# EAGLE design freiBot_pro_micro_DIP_v1.0 (EAGLE 7.5.0)
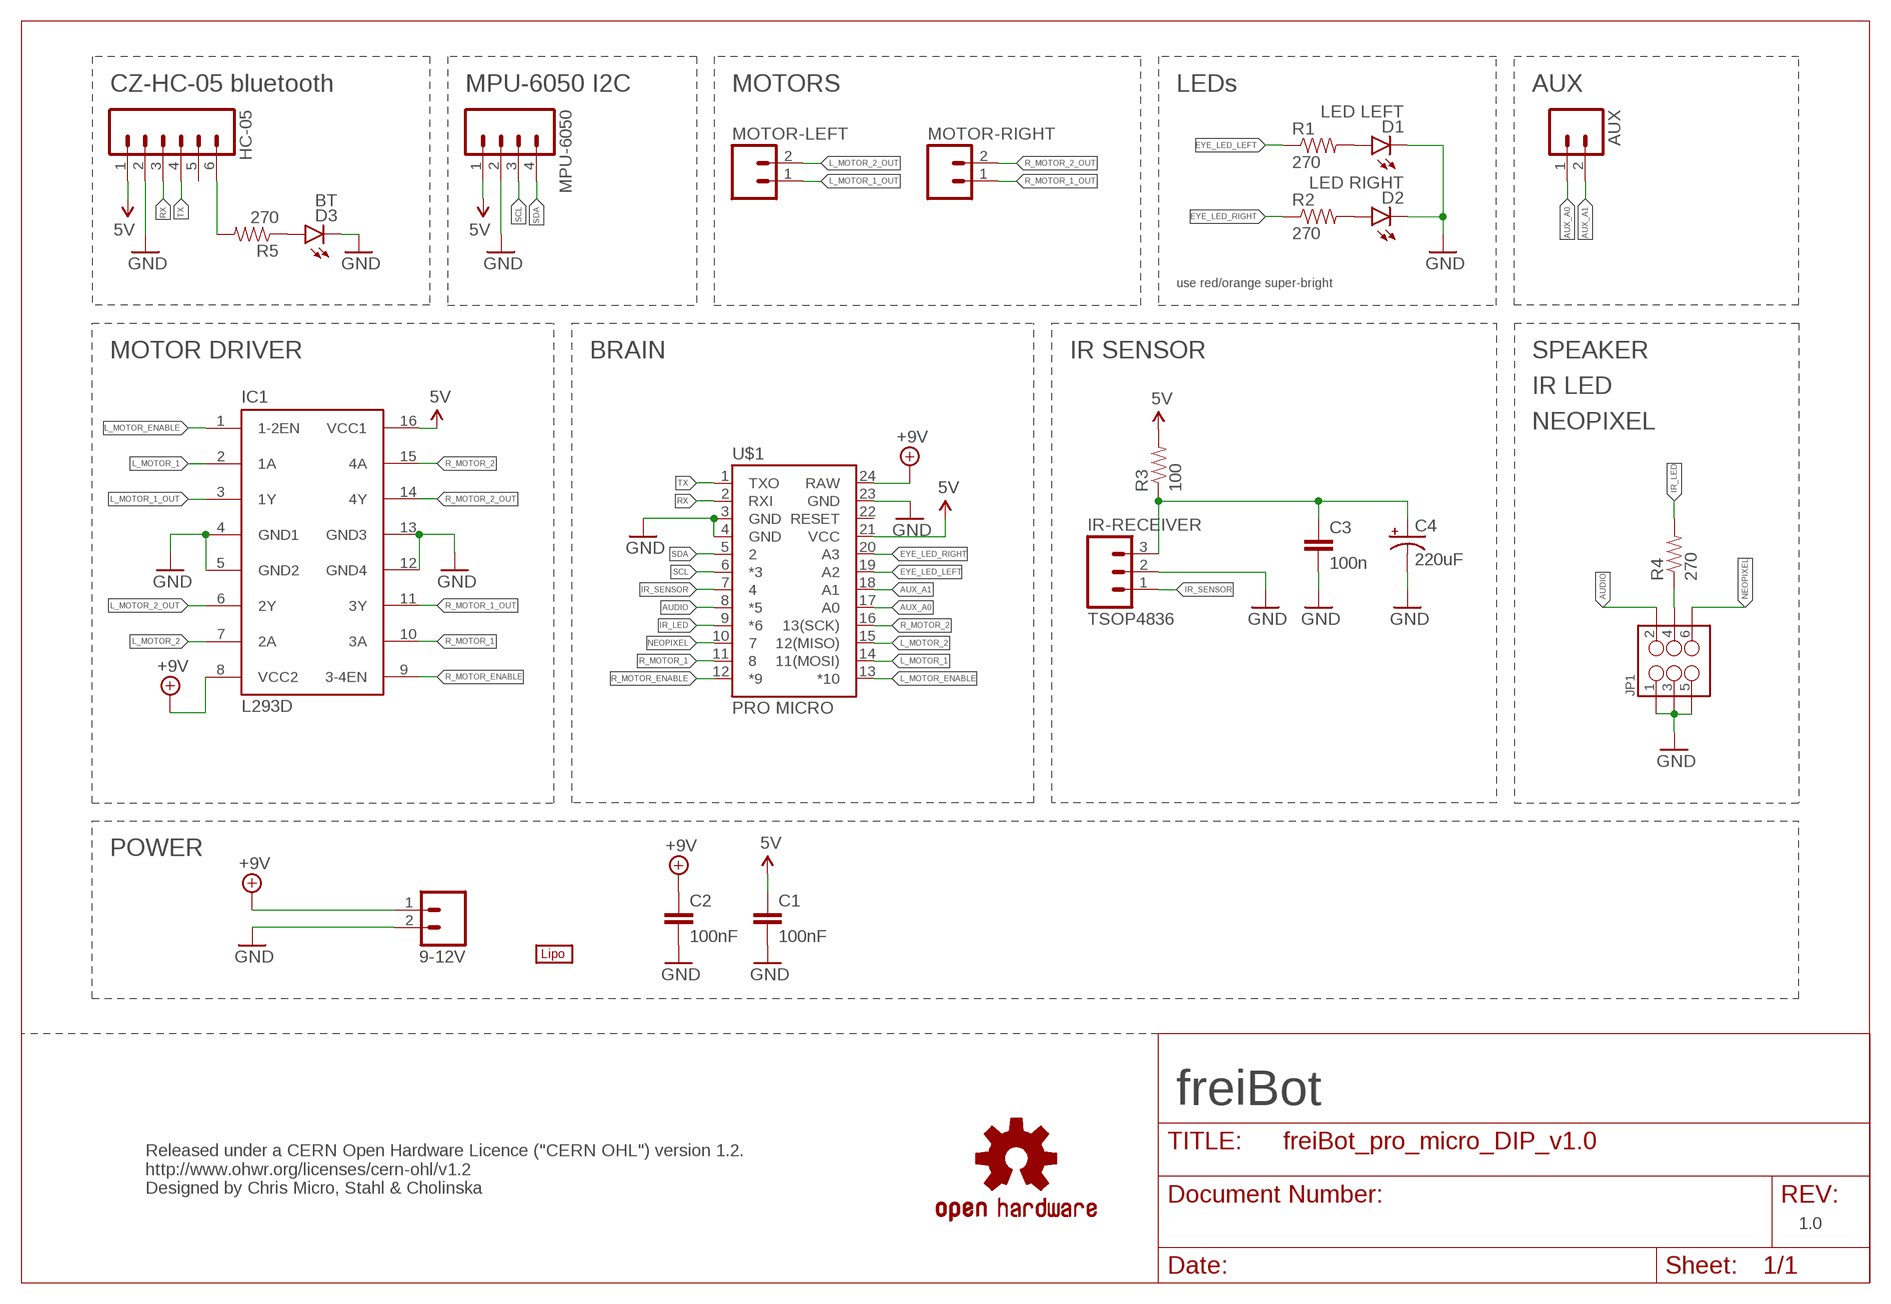
[diagram p0: schematic, sheet 1]

## Parts
9-12V  M025MM  [SCREWTERMINAL-5MM-2]
AUX  M02LOCK_LONGPADS  [1X02_LOCK_LONGPADS]
C1  100nF  0.1UF-50V-20%(PTH)KIT-EZ  [CAP-PTH-SMALL-KIT]
C2  100nF  0.1UF-50V-20%(PTH)KIT-EZ  [CAP-PTH-SMALL-KIT]
C3  100n  0.1UF-50V-20%(PTH)KIT-EZ  [CAP-PTH-SMALL-KIT]
C4  220uF  CAP_POLPTH1  [CPOL-RADIAL-100UF-25V]
D1  LED LEFT  LED3MM  [LED3MM]
D2  LED RIGHT  LED3MM  [LED3MM]
D3  BT  LED3MM  [LED3MM]
HC-05  M06LONGPADS  [1X06_LONGPADS]
IC1  L293D  [DIL16]
IR-RECEIVER  TSOP4836  M03LONGPADS  [1X03_LONGPADS]
JP1  M03X2NO_SILK  [2X3-NS]
LOGO1  OSHW-LOGOL-COPPER  [OSHW-LOGO-L_COPPER]
MOTOR-LEFT  M025MM  [SCREWTERMINAL-5MM-2]
MOTOR-RIGHT  M025MM  [SCREWTERMINAL-5MM-2]
MPU-6050  M04LONGPADS  [1X04_LONGPADS]
R1  270  RESISTORKIT  [AXIAL-0.3-KIT]
R2  270  RESISTORKIT  [AXIAL-0.3-KIT]
R3  100  RESISTORKIT  [AXIAL-0.3-KIT]
R4  270  RESISTORKIT  [AXIAL-0.3-KIT]
R5  270  RESISTORKIT  [AXIAL-0.3-KIT]
U$1  PRO MICRO  ARDUINO_PRO_MICRO  [ARDUINO_PRO_MICRO]
U$2  LIPO-OUTLINE2000  [LIPO-2000]

## Nets
5V: C1.1 HC-05.1 IC1.16(VCC1) MPU-6050.1 R3.P$2 U$1.21(VCC)
+9V: 9-12V.1 C2.1 IC1.8(VCC2) U$1.24(RAW)
AUDIO: JP1.2 U$1.8(*5)
AUX_A0: AUX.1 U$1.17(A0)
AUX_A1: AUX.2 U$1.18(A1)
EYE_LED_LEFT: R1.P$1 U$1.19(A2)
EYE_LED_RIGHT: R2.P$1 U$1.20(A3)
GND: 9-12V.2 C1.2 C2.2 C3.2 C4.2(-) D1.K(C) D2.K(C) D3.K(C) HC-05.2 IC1.4(GND1) IC1.5(GND2) IC1.12(GND4) IC1.13(GND3) IR-RECEIVER.2 JP1.1 JP1.3 JP1.5 MPU-6050.2 U$1.3(GND) U$1.4(GND) U$1.23(GND)
IR_LED: R4.P$2 U$1.9(*6)
IR_SENSOR: IR-RECEIVER.1 U$1.7
L_MOTOR_1: IC1.2(1A) U$1.14(11(MOSI))
L_MOTOR_1_OUT: IC1.3(1Y) MOTOR-LEFT.1
L_MOTOR_2: IC1.7(2A) U$1.15(12(MISO))
L_MOTOR_2_OUT: IC1.6(2Y) MOTOR-LEFT.2
L_MOTOR_ENABLE: IC1.1(1-2EN) U$1.13(*10)
N$1: D1.A R1.P$2
N$2: D2.A R2.P$2
N$3: D3.A R5.P$1
N$4: JP1.4 R4.P$1
N$5: HC-05.6 R5.P$2
N$6: C3.1 C4.1(+) IR-RECEIVER.3 R3.P$1
NEOPIXEL: JP1.6 U$1.10
R_MOTOR_1: IC1.10(3A) U$1.11
R_MOTOR_1_OUT: IC1.11(3Y) MOTOR-RIGHT.1
R_MOTOR_2: IC1.15(4A) U$1.16(13(SCK))
R_MOTOR_2_OUT: IC1.14(4Y) MOTOR-RIGHT.2
R_MOTOR_ENABLE: IC1.9(3-4EN) U$1.12(*9)
RX: HC-05.3 U$1.2(RXI)
SCL: MPU-6050.3 U$1.6(*3)
SDA: MPU-6050.4 U$1.5
TX: HC-05.4 U$1.1(TXO)
Unconnected: HC-05.5 U$1.22(RESET)

## Notes on the sheet
- CZ-HC-05 bluetooth | MPU-6050 I2C | MOTORS | LEDs | AUX
- use red/orange super-bright
- MOTOR DRIVER | BRAIN | IR SENSOR | SPEAKER
- IR LED
- NEOPIXEL
- POWER
- freiBot
- Released under a CERN Open Hardware Licence ("CERN OHL") version 1.2.
  http://www.ohwr.org/licenses/cern-ohl/v1.2
  Designed by Chris Micro, Stahl & Cholinska
- 1.0

## Library data of the parts
9-12V MOTOR-LEFT MOTOR-RIGHT = SparkFun-Connectors:M02: Standard 2-pin 0.1" header. Use with - straight break away headers ( PRT-00116) - right angle break away headers (PRT-00553) - swiss pins (PRT-00743) - machine pins (PRT-00117) - female headers (PRT-00115) Molex polarized connector foot print use with: PRT-08233 with associated crimp pins and housings. 2.54_SCREWTERM for use with PRT-10571. 3.5mm Screw Terminal footprints for PRT-08084 5mm Screw Terminal footprints for use with PRT-08432; STOREFRONT_ID: PRT-08432
AUX = SparkFun-Connectors:M02: Standard 2-pin 0.1" header. Use with - straight break away headers ( PRT-00116) - right angle break away headers (PRT-00553) - swiss pins (PRT-00743) - machine pins (PRT-00117) - female headers (PRT-00115) Molex polarized connector foot print use with: PRT-08233 with associated crimp pins and housings. 2.54_SCREWTERM for use with PRT-10571. 3.5mm Screw Terminal footprints for PRT-08084 5mm Screw Terminal footprints for use with PRT-08432
C1-C3 = SparkFun-Capacitors:0.1UF-50V-20%(PTH): CAP-08370; PROD_ID: CAP-08370
C4 = SparkFun-Capacitors:CAP_POL: Capacitor Polarized These are standard SMD and PTH capacitors. Normally 10uF, 47uF, and 100uF in electrolytic and tantalum varieties. Always verify the external diameter of the through hole cap, it varies with capacity, voltage, and manufacturer. The EIA devices should be standard.
D1-D3 = SparkFun-LED:LED: LEDs Standard schematic elements and footprints for 5mm, 3mm, 1206, and 0603 sized LEDs. 5mm - Spark Fun Electronics SKU : COM-00529 (and others)
HC-05 = SparkFun-Connectors:M06: Header 6 Standard 6-pin 0.1" header. Use with straight break away headers (SKU : PRT-00116), right angle break away headers (PRT-00553), swiss pins (PRT-00743), machine pins (PRT-00117), and female headers (PRT-00115). Molex polarized connector foot print use with SKU : PRT-08094 with associated crimp pins and housings. NOTES ON THE VARIANTS LOCK and LOCK_LONGPADS... This footprint was designed to help hold the alignment of a through-hole component (i.e. 6-pin header) while soldering it into place. You may notice that each hole has been shifted either up or down by 0.005 of an inch from it's more standard position (which is a perfectly straight line). This slight alteration caused the pins (the squares in the middle) to touch the edges of the holes. Because they are alternating, it causes a "brace" to hold the component in place. 0.005 has proven to be the perfect amount of "off-center" position when using our standard breakaway headers. Although looks a little odd when you look at the bare footprint, once you have a header in there, the alteration is very hard to notice. Also,if you push a header all the way into place, it is covered up entirely on the bottom side. This idea of altering the position of holes to aid alignment will be further integrated into the Sparkfun Library for other footprints. It can help hold any component with 3 or more connection pins.
IC1 = st-microelectronics:L293D: PUSH-PULL 4 CHANNEL DRIVER; MPN: L293D; OC_FARNELL: 9589619; OC_NEWARK: 56P8249
IR-RECEIVER = SparkFun-Connectors:M03: Header 3 Standard 3-pin 0.1" header. Use with straight break away headers (SKU : PRT-00116), right angle break away headers (PRT-00553), swiss pins (PRT-00743), machine pins (PRT-00117), and female headers (PRT-00115). Molex polarized connector foot print use with SKU : PRT-08232 with associated crimp pins and housings.
JP1 = SparkFun-Connectors:M03X2: 2x3 .1" header. Shrouded, with keying- CONN-10681 SMT- CONN-11415 Pogo pins- HW-11044
LOGO1 = SparkFun-Aesthetics:OSHW-LOGO: Open Source Hardware Logo This logo indicates the piece of hardware it is found on incorporates a OSHW license and/or adheres to the definition of open source hardware found here: http://freedomdefined.org/OSHW
MPU-6050 = SparkFun-Connectors:M04: Header 4 Standard 4-pin 0.1" header. Use with straight break away headers (SKU : PRT-00116), right angle break away headers (PRT-00553), swiss pins (PRT-00743), machine pins (PRT-00117), and female headers (PRT-00115). Molex polarized connector foot print use with SKU : PRT-08231 with associated crimp pins and housings. 1MM SMD Version SKU: PRT-10208
R1-R5 = SparkFun-Resistors:RESISTOR: Resistor Basic schematic elements and footprints for 0603, 1206, and PTH resistors.
U$1 = SparkFun-Boards:ARDUINO_PRO_MICRO
U$2 = SparkFun-Electromechanical:LIPO-OUTLINE: Outlines for common LiPo batteries sold by SparkFun. For fit only- no pads or connectors!

## Board
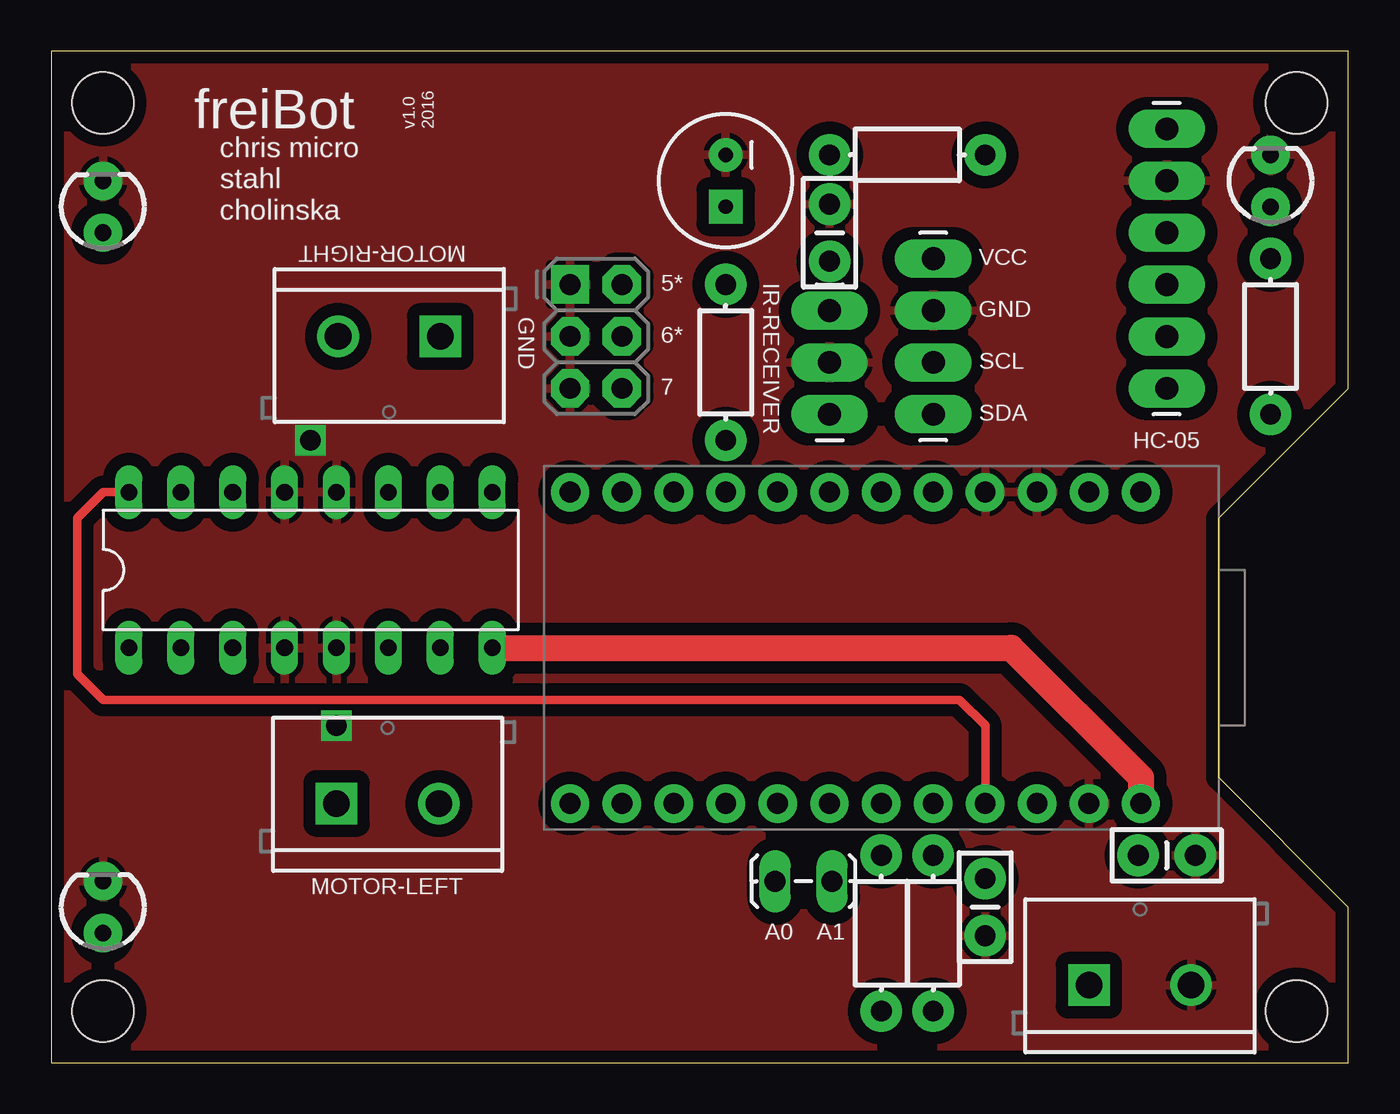
[diagram p1: board, top side]
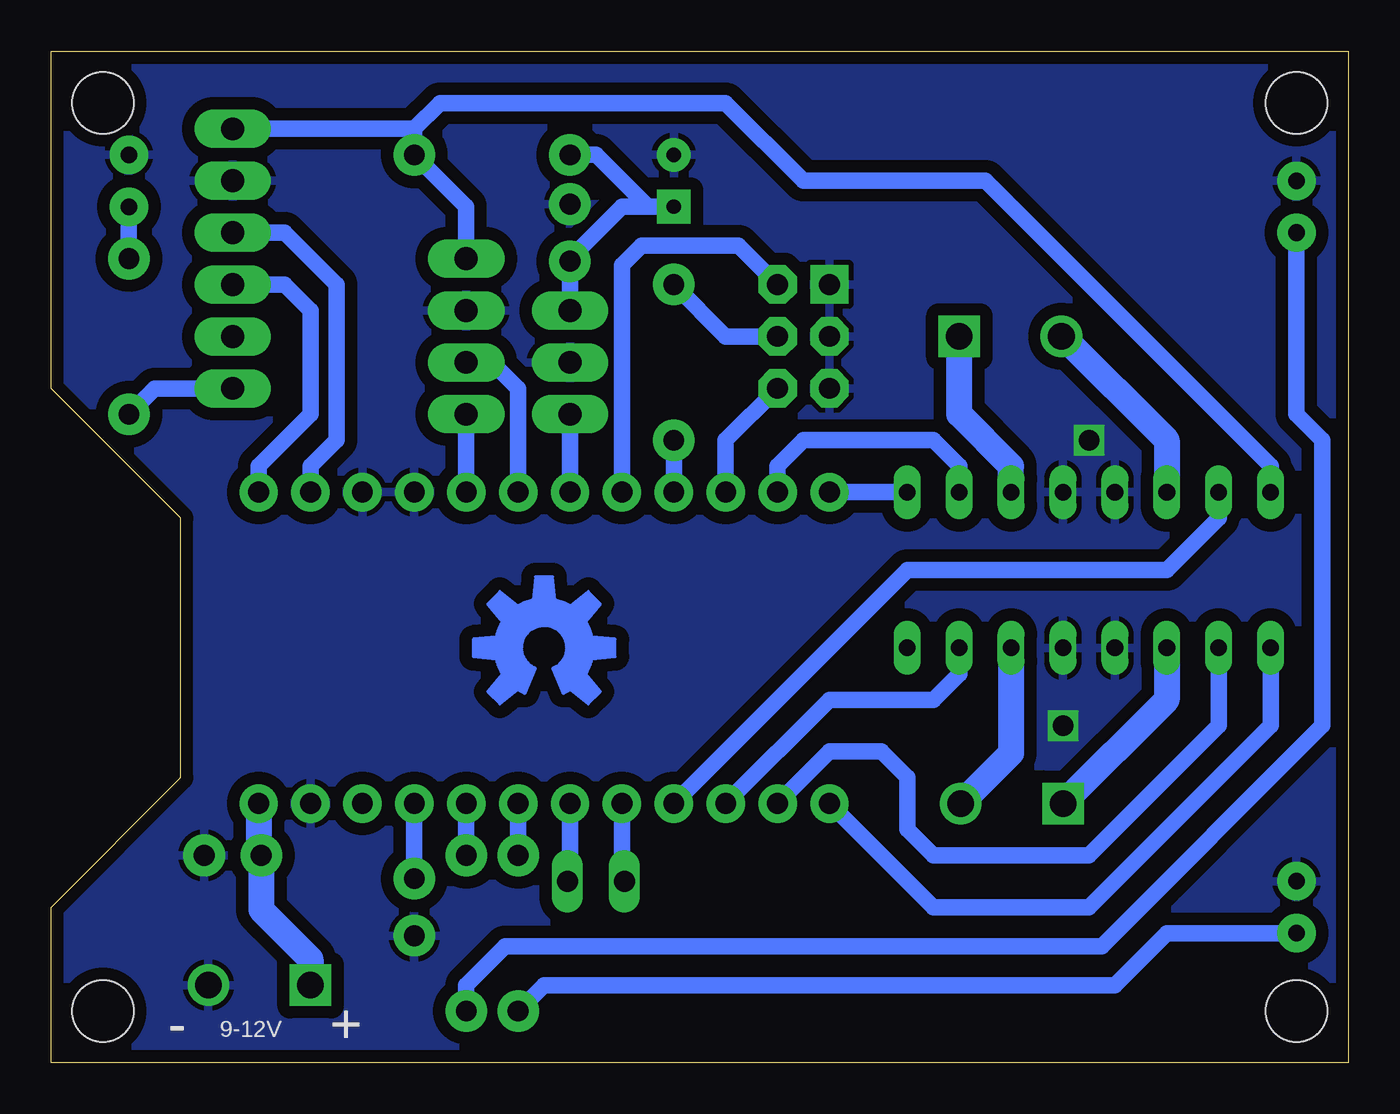
[diagram p2: board, bottom side, seen from below]

Size 63.5 x 49.53 mm. Coordinates in mm from the lower left corner, seen from the top.
Outline: 0,0 63.5,0 63.5,7.62 57.15,13.97 57.15,26.67 63.5,33.02 63.5,49.53 0,49.53 0,0
Copper layers (1*16): Top 0.035mm / dielectric 1.5mm / Bottom 0.035mm
Design rules "SeeedStudio_2layer_DRU_no_angle_20140221": minimum track width 6mil, minimum drill 12mil, track to track 6mil, track to pad 6mil, pad to pad 6mil, via to via 6mil, smd to smd 0mil, copper to edge 10mil, drill to drill 10mil, minimum pad ring 10mil, minimum via ring 6mil, stop-mask expansion 2mil, vias tented up to drill 100mil, thermal gap 10mil
Holes 3 mm at 2.54,46.99 2.54,2.54 60.96,46.99 60.96,2.54

### Footprints (pad centres in the part's own frame; a part is rotated, then mirrored left to right if it is on the bottom)
SCREWTERMINAL-5MM-2 = drill 1.3 pad 2.032 square: 1 0,0 | drill 1.3 pad 2.032: 2 5,0
1X02_LOCK_LONGPADS = drill 1.016 long: 1 -0.127,0; 2 2.667,0
CAP-PTH-SMALL-KIT = drill 1.016 pad 2.032: 1 -1.397,0; 2 1.397,0
CPOL-RADIAL-100UF-25V = drill 0.7 pad 1.651 square: 1 1.27,0 | drill 0.7 pad 1.651: 2 -1.27,0
LED3MM = drill 0.813 pad 1.88: A -1.27,0; K 1.27,0
1X06_LONGPADS = drill 1.118 pad 1.88 long: 1 0,0; 2 2.54,0; 3 5.08,0; 4 7.62,0; 5 10.16,0; 6 12.7,0
DIL16 = drill 0.813 long: 1 -8.89,-3.81; 2 -6.35,-3.81; 3 -3.81,-3.81; 4 -1.27,-3.81; 5 1.27,-3.81; 6 3.81,-3.81; 7 6.35,-3.81; 8 8.89,-3.81; 9 8.89,3.81; 10 6.35,3.81; 11 3.81,3.81; 12 1.27,3.81; 13 -1.27,3.81; 14 -3.81,3.81; 15 -6.35,3.81; 16 -8.89,3.81
1X03_LONGPADS = drill 1.118 pad 1.88 long: 1 0,0; 2 2.54,0; 3 5.08,0
2X3-NS = drill 1.016 pad 1.88 square: 1 -2.54,-1.27 | drill 1.016 pad 1.88 octagon: 2 -2.54,1.27; 3 0,-1.27; 4 0,1.27; 5 2.54,-1.27; 6 2.54,1.27
1X04_LONGPADS = drill 1.118 pad 1.88 long: 1 0,0; 2 2.54,0; 3 5.08,0; 4 7.62,0
AXIAL-0.3-KIT = drill 1.016 pad 2.032: P$1 -3.81,0; P$2 3.81,0
ARDUINO_PRO_MICRO = drill 1.016 pad 1.88: 1 -7.62,12.7; 2 -7.62,10.16; 3 -7.62,7.62; 4 -7.62,5.08; 5 -7.62,2.54; 6 -7.62,0; 7 -7.62,-2.54; 8 -7.62,-5.08; 9 -7.62,-7.62; 10 -7.62,-10.16; 11 -7.62,-12.7; 12 -7.62,-15.24; 13 7.62,-15.24; 14 7.62,-12.7; 15 7.62,-10.16; 16 7.62,-7.62; 17 7.62,-5.08; 18 7.62,-2.54; 19 7.62,0; 20 7.62,2.54; 21 7.62,5.08; 22 7.62,7.62; 23 7.62,10.16; 24 7.62,12.7

### Placement (x,y rotation side)
9-12V  50.8,3.81 0 top
AUX  35.56,8.89 0 top
C1  45.72,7.62 270 top
C2  54.61,10.16 0 top
C3  38.1,40.64 90 top
C4  33.02,43.18 270 top
D1  2.54,7.62 90 top
D2  2.54,41.91 90 top
D3  59.69,43.18 90 top
HC-05  54.61,45.72 270 top
IC1  12.7,24.13 0 top
IR-RECEIVER  38.1,31.75 90 top
JP1  26.67,35.56 270 top
LOGO1  39.37,20.32 0 bottom
MOTOR-LEFT  13.97,12.7 0 top
MOTOR-RIGHT  19.05,35.56 180 top
MPU-6050  43.18,39.37 270 top
R1  40.64,6.35 270 top
R2  43.18,6.35 270 top
R3  41.91,44.45 0 top
R4  33.02,34.29 270 top
R5  59.69,35.56 270 top
U$1  40.64,20.32 270 top
U$2  71.12,-5.08 0 top  (outside the outline)

### Tracks (layer width: path | path; a pad name or v marks a point on that pad's centre or on a via)
5V
  Top 0.406: U$1.21 45.72,16.51 44.45,17.78 2.54,17.78 1.27,19.05 1.27,26.67 2.54,27.94 IC1.16
  Bottom 0.813: U$1.21 C1.1 45.72,8.89 | IC1.16 3.81,29.21 17.78,43.18 26.67,43.18 30.48,46.99 44.45,46.99 45.72,45.72 | HC-05.1 45.72,45.72 | MPU-6050.1 43.18,41.91 R3.P$2 45.72,45.72
+9V
  Top 1.27: IC1.8 46.99,20.32 53.34,13.97 U$1.24
  Bottom 1.27: U$1.24 53.34,10.29 C2.1 53.21,7.49 50.8,5.08 9-12V.1
AUDIO
  Bottom 0.813: U$1.8 35.56,39.05 34.61,40.01 29.84,40.01 JP1.2
AUX_A0
  Bottom 0.813: U$1.17 35.56,9.02 AUX.1
AUX_A1
  Bottom 0.813: U$1.18 38.1,9.02 AUX.2
EYE_LED_LEFT
  Bottom 0.813: U$1.19 R1.P$1
EYE_LED_RIGHT
  Bottom 0.813: U$1.20 R2.P$1
GND  (via drill 1 pad 0.81)
  other vias: 12.7,30.48 13.97,16.51
  pour Top (isolate 0.61): -0.95,50.8 64.77,50.8 64.77,-1.27 -1.27,-1.27
  pour Bottom (isolate 0.61): -0.95,50.8 64.77,50.8 64.77,-1.27 -1.27,-1.27
IR_LED
  Bottom 0.813: U$1.9 R4.P$2
IR_SENSOR
  Bottom 0.813: U$1.7 IR-RECEIVER.1
L_MOTOR_1
  Bottom 0.813: IC1.2 6.35,16.51 12.7,10.16 20.32,10.16 21.59,11.43 21.59,13.97 22.86,15.24 25.4,15.24 U$1.14
L_MOTOR_1_OUT
  Bottom 1.27: IC1.3 8.89,17.78 MOTOR-LEFT.1
L_MOTOR_2
  Bottom 0.813: IC1.7 19.05,19.05 20.32,17.78 25.4,17.78 U$1.15
L_MOTOR_2_OUT
  Bottom 1.27: IC1.6 16.51,15.16 MOTOR-LEFT.2
L_MOTOR_ENABLE
  Bottom 0.813: IC1.1 3.81,16.51 12.7,7.62 20.32,7.62 U$1.13
N$1
  Bottom 0.813: R1.P$2 39.37,3.81 11.43,3.81 8.89,6.35 D1.A
N$2
  Bottom 0.813: D2.A 2.54,31.75 1.27,30.48 1.27,16.51 12.06,5.71 41.27,5.71 43.18,3.81 R2.P$2
N$3
  Bottom 0.813: R5.P$1 D3.A
N$4
  Bottom 0.813: JP1.4 30.48,35.56 R4.P$1
N$5
  Bottom 0.813: R5.P$2 58.42,33.02 HC-05.6
N$6
  Bottom 0.813: IR-RECEIVER.3 C3.1 38.1,39.37 35.56,41.91 C4.1 34.29,41.91 36.83,44.45 R3.P$1
NEOPIXEL
  Bottom 0.813: U$1.10 30.48,30.48 JP1.6
R_MOTOR_1
  Bottom 0.813: U$1.11 27.94,29.21 26.67,30.48 20.32,30.48 19.05,29.21 IC1.10
R_MOTOR_1_OUT
  Bottom 1.27: IC1.11 16.51,29.21 19.05,31.75 MOTOR-RIGHT.1
R_MOTOR_2
  Bottom 0.813: U$1.16 21.59,24.13 8.89,24.13 6.35,26.67 IC1.15
R_MOTOR_2_OUT
  Bottom 1.27: MOTOR-RIGHT.2 13.97,35.56 8.89,30.48 IC1.14
R_MOTOR_ENABLE
  Bottom 0.813: IC1.9 U$1.12
RX
  Bottom 0.813: U$1.2 50.8,29.21 49.53,30.48 49.53,38.1 52.07,40.64 HC-05.3
SCL
  Bottom 0.813: U$1.6 40.64,33.02 41.91,34.29 MPU-6050.3
SDA
  Bottom 0.813: U$1.5 MPU-6050.4
TX
  Bottom 0.813: U$1.1 53.34,29.21 50.8,31.75 50.8,36.83 52.07,38.1 HC-05.4

### Text on the board
tPlace: freiBot | v1.0 / 2016 | chris micro / stahl / cholinska | 5* | GND | 6* | 7 | A0 | A1
tNames: VCC | GND | SCL | SDA
bNames: + | -